# EAGLE design hexa4101 (EAGLE 5.11)
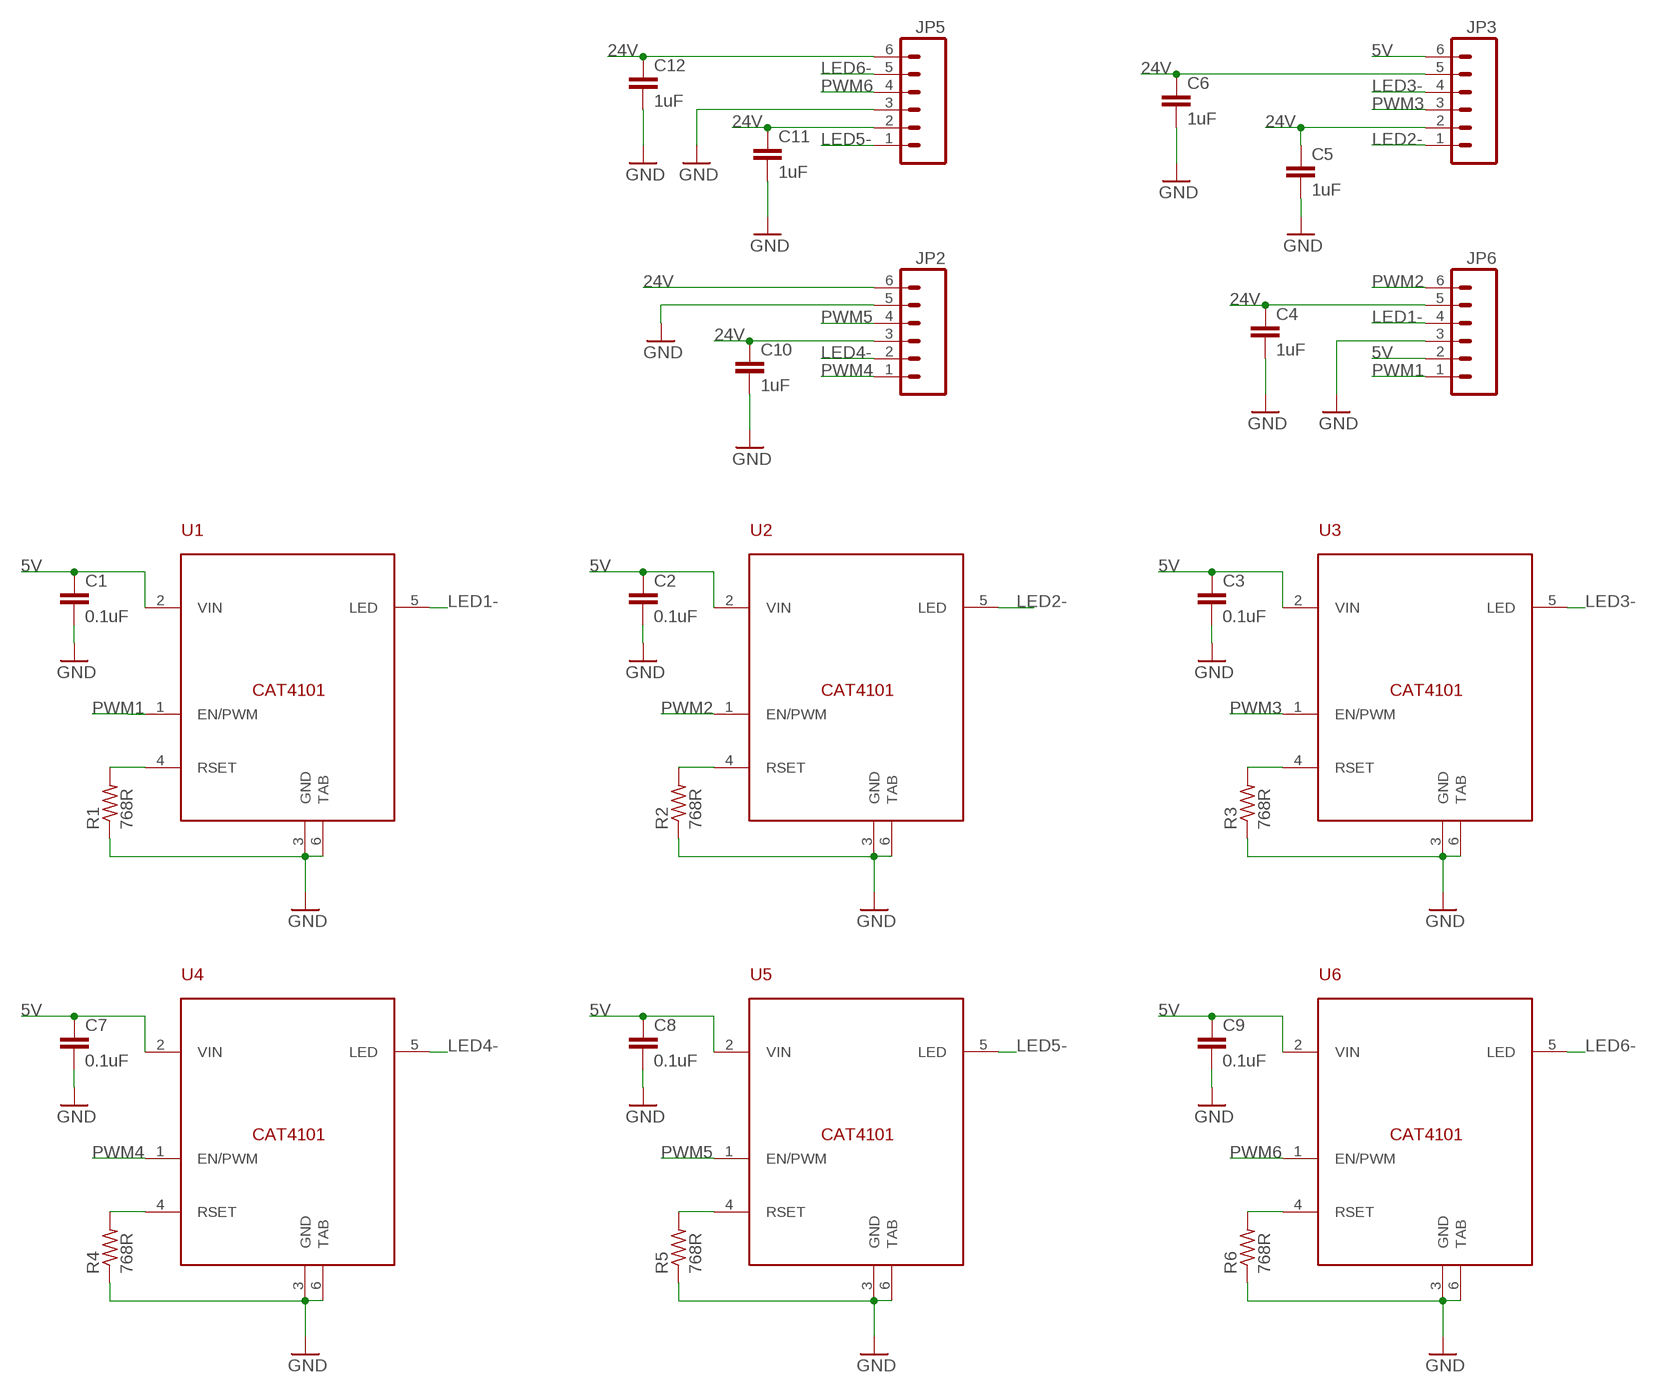
[diagram p0: schematic, sheet 1]

## Parts
C1  0.1uF  CAP1206  [C1206]
C2  0.1uF  CAP1206  [C1206]
C3  0.1uF  CAP1206  [C1206]
C4  1uF  CAP1206  [C1206]
C5  1uF  CAP1206  [C1206]
C6  1uF  CAP1206  [C1206]
C7  0.1uF  CAP1206  [C1206]
C8  0.1uF  CAP1206  [C1206]
C9  0.1uF  CAP1206  [C1206]
C10  1uF  CAP1206  [C1206]
C11  1uF  CAP1206  [C1206]
C12  1uF  CAP1206  [C1206]
JP2  M06SCREW3.5MM6  [SCREWTERMINAL-3.5MM-6]
JP3  M06SCREW3.5MM6  [SCREWTERMINAL-3.5MM-6]
JP5  M06SCREW3.5MM6  [SCREWTERMINAL-3.5MM-6]
JP6  M06SCREW3.5MM6  [SCREWTERMINAL-3.5MM-6]
R1  768R  R-US_R1206  [R1206]
R2  768R  R-US_R1206  [R1206]
R3  768R  R-US_R1206  [R1206]
R4  768R  R-US_R1206  [R1206]
R5  768R  R-US_R1206  [R1206]
R6  768R  R-US_R1206  [R1206]
U1  CAT4101  [TO263-51]
U2  CAT4101  [TO263-51]
U3  CAT4101  [TO263-51]
U4  CAT4101  [TO263-51]
U5  CAT4101  [TO263-51]
U6  CAT4101  [TO263-51]

## Nets
5V: C1.1 C2.1 C3.1 C7.1 C8.1 C9.1 JP3.6 JP6.2 U1.2(VIN) U2.2(VIN) U3.2(VIN) U4.2(VIN) U5.2(VIN) U6.2(VIN)
24V: C4.1 C5.1 C6.1 C10.1 C11.1 C12.1 JP2.3 JP2.6 JP3.2 JP3.5 JP5.2 JP5.6 JP6.5
GND: C1.2 C2.2 C3.2 C4.2 C5.2 C6.2 C7.2 C8.2 C9.2 C10.2 C11.2 C12.2 JP2.5 JP5.3 JP6.3 R1.1 R2.1 R3.1 R4.1 R5.1 R6.1 U1.3(GND) U1.6(TAB) U2.3(GND) U2.6(TAB) U3.3(GND) U3.6(TAB) U4.3(GND) U4.6(TAB) U5.3(GND) U5.6(TAB) U6.3(GND) U6.6(TAB)
LED1-: JP6.4 U1.5(LED)
LED2-: JP3.1 U2.5(LED)
LED3-: JP3.4 U3.5(LED)
LED4-: JP2.2 U4.5(LED)
LED5-: JP5.1 U5.5(LED)
LED6-: JP5.5 U6.5(LED)
N$1: R1.2 U1.4(RSET)
N$2: R2.2 U2.4(RSET)
N$3: R3.2 U3.4(RSET)
N$4: R4.2 U4.4(RSET)
N$5: R5.2 U5.4(RSET)
N$6: R6.2 U6.4(RSET)
PWM1: JP6.1 U1.1(EN/PWM)
PWM2: JP6.6 U2.1(EN/PWM)
PWM3: JP3.3 U3.1(EN/PWM)
PWM4: JP2.1 U4.1(EN/PWM)
PWM5: JP2.4 U5.1(EN/PWM)
PWM6: JP5.4 U6.1(EN/PWM)

## Library data of the parts
C1-C12 = _allyourbase:CAP: Capacitor Standard 0603 ceramic capacitor, and 0.1" leaded capacitor.
JP2 JP3 JP5 JP6 = _allyourbase:M06: Header 6 Standard 6-pin 0.1" header. Use with straight break away headers (SKU : PRT-00116), right angle break away headers (PRT-00553), swiss pins (PRT-00743), machine pins (PRT-00117), and female headers (PRT-00115). Molex polarized connector foot print use with SKU : PRT-08094 with associated crimp pins and housings. NOTES ON THE VARIANTS LOCK and LOCK_LONGPADS... This footprint was designed to help hold the alignment of a through-hole component (i.e. 6-pin header) while soldering it into place. You may notice that each hole has been shifted either up or down by 0.005 of an inch from it's more standard position (which is a perfectly straight line). This slight alteration caused the pins (the squares in the middle) to touch the edges of the holes. Because they are alternating, it causes a "brace" to hold the component in place. 0.005 has proven to be the perfect amount of "off-center" position when using our standard breakaway headers. Although looks a little odd when you look at the bare footprint, once you have a header in there, the alteration is very hard to notice. Also, if you push a header all the way into place, it is covered up entirely on the bottom side. This idea of altering the position of holes to aid alignment will be further integrated into the Sparkfun Library for other footprints. It can help hold any component with 3 or more connection pins.
R1-R6 = _allyourbase:R-US_: RESISTOR, American symbol
U1-U6 = _allyourbase:CAT4101

## Board
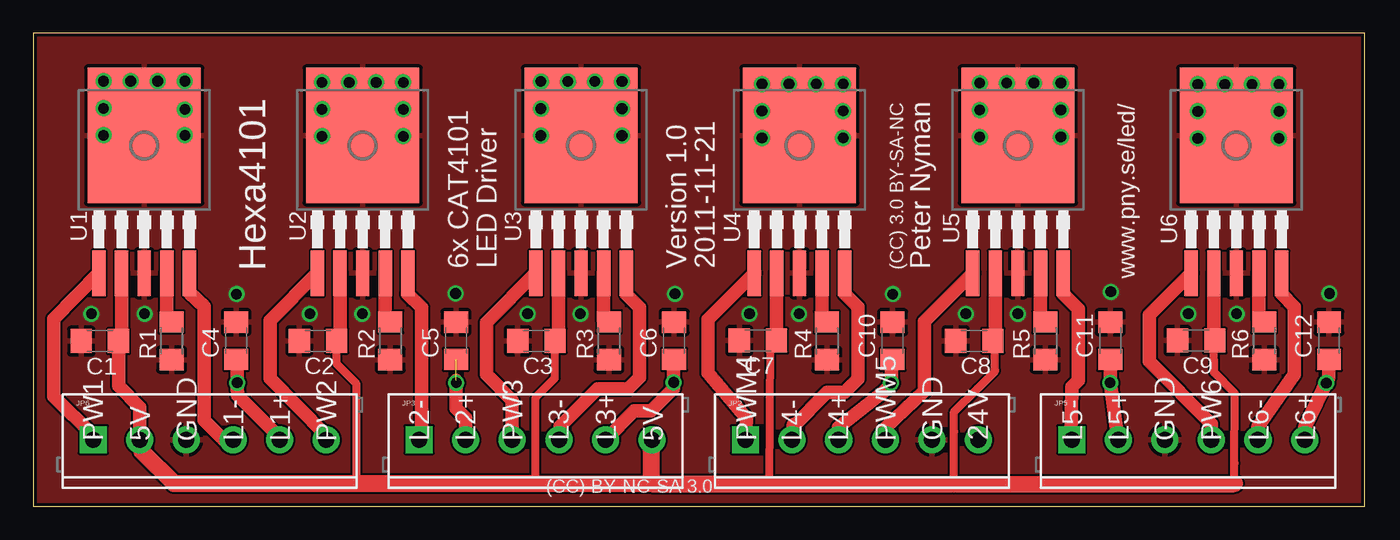
[diagram p1: board, top side]
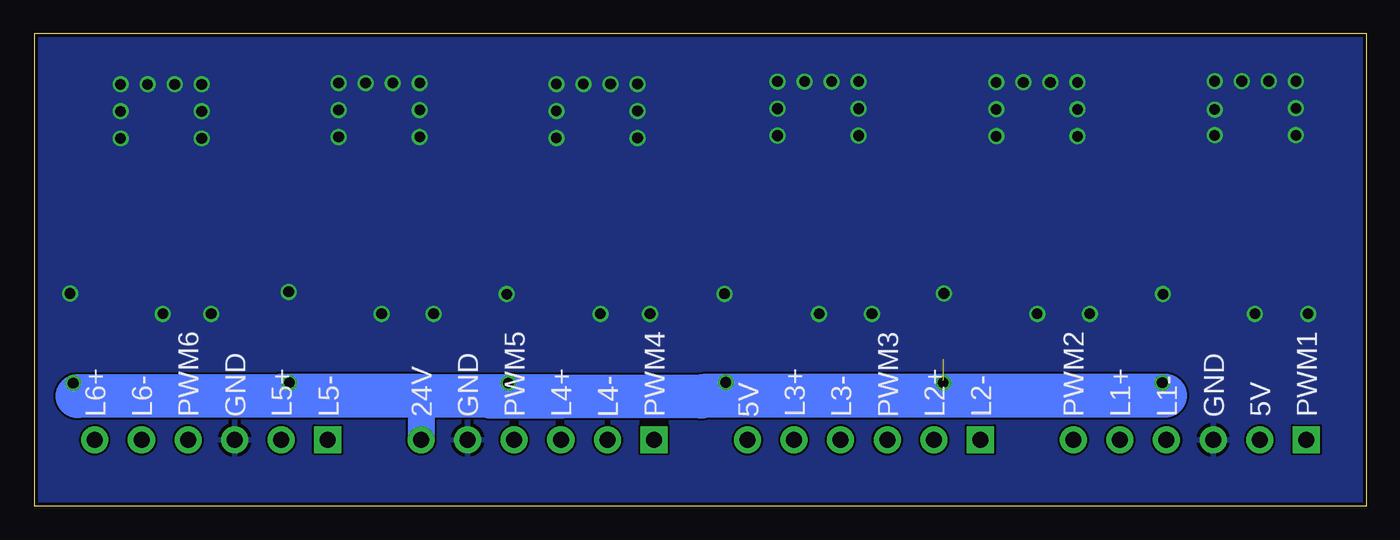
[diagram p2: board, bottom side, seen from below]

Size 100 x 35.56 mm. Coordinates in mm from the lower left corner, seen from the top.
Outline: 0,0 100,0 100,35.56 0,35.56 0,0
Copper layers (1*16): Top 0.035mm / dielectric 1.5mm / Bottom 0.035mm
Design rules "iTead-Seeed-DRC": minimum track width 6mil, minimum drill 12mil, track to track 6mil, track to pad 6mil, pad to pad 6mil, via to via 6mil, smd to smd 0mil, copper to edge 10mil, drill to drill 10mil, minimum pad ring 10mil, minimum via ring 6mil, stop-mask expansion 2mil, vias tented up to drill 100mil, thermal gap 10mil

### Footprints (pad centres in the part's own frame; a part is rotated, then mirrored left to right if it is on the bottom)
C1206 = smd 1.6 x 1.8: 1 -1.4,0; 2 1.4,0
SCREWTERMINAL-3.5MM-6 = drill 1.2 pad 2.032 square: 1 0,0 | drill 1.2 pad 2.032 round: 2 3.5,0; 3 7,0; 4 10.5,0; 5 14,0; 6 17.5,0
R1206 = smd 1.6 x 1.803: 1 -1.422,0; 2 1.422,0
TO263-51 = smd 1 x 3.4: 1 -3.4,-6.6; 2 -1.7,-6.6; 3 0,-6.6; 4 1.7,-6.6; 5 3.4,-6.6 | smd 8.5 x 10.16: 6 0,3.754

### Placement (x,y rotation side)
C1  5,12.42 180 top
C2  21.39,12.45 180 top
C3  37.8,12.45 180 top
C4  15.24,12.45 90 top
C5  31.75,12.45 90 top
C6  48.13,12.45 90 top
C7  54.43,12.47 180 top
C8  70.69,12.45 180 top
C9  87.35,12.47 180 top
C10  64.54,12.45 90 top
C11  80.9,12.45 90 top
C12  97.33,12.45 90 top
JP2  53.5,5 0 top
JP3  28.98,5 0 top
JP5  78,5 0 top
JP6  4.5,5 0 top
R1  10.39,12.45 90 top
R2  26.82,12.45 90 top
R3  43.23,12.45 90 top
R4  59.61,12.45 90 top
R5  76.02,12.45 90 top
R6  92.46,12.45 90 top
U1  8.33,24.13 0 top
U2  24.74,24.13 0 top
U3  41.15,24.13 0 top
U4  57.56,24.13 0 top
U5  73.96,24.13 0 top
U6  90.37,24.13 0 top

### Tracks (layer width: path | path; a pad name or v marks a point on that pad's centre or on a via)
5V
  Top 0.406: 88.67,12.52 C9.1 | 72.27,12.47 C8.1 72.24,12.45 | 55.83,17.55 U4.2 | 55.8,12.47 C7.1 | 46.46,5 JP3.6
  Top 0.61: 39.45,12.16 38.74,12.09 C3.1 39.19,10.18 39.19,9.65 37.74,8.2 37.74,1.72 | C1.1 6.63,12.22 | 23.04,12.6 C2.1 22.79,10.7 24.28,9.2 24.28,1.72 | 55.8,12.47 55.36,12.15 55.32,7 55.31,1.71 | 72.24,12.45 72.24,10.24 72.26,10.24 72.26,10.19 70.92,8.84 69.16,7.11 69.16,5.61 69.16,1.66 | U6.2 88.69,12.17 88.7,10.06 90.25,8.51 90.25,8.18 90.23,3.25 90.23,1.7
  Top 1.003: 39.45,12.16 U3.2 | 6.63,12.22 U1.2 | 23.04,12.6 U2.2 | U6.2 88.67,12.52 | 72.27,12.47 U5.2 | C7.1 55.83,17.55
  Top 1.016: C1.1 6.4,9.04 8,7.44 JP6.2 8.15,4.12
  Top 1.27: 46.46,1.72 37.74,1.72 24.28,1.72 10.57,1.72 8.15,4.12 | 46.46,1.72 55.31,1.71 69.16,1.66 90.23,1.7 | 46.46,1.72 46.46,5
24V  (via drill 0.8)  (1 unrouted)
  Top 0.406: 15.32,10.97 C4.1 | 15.32,8.99 v15.32,9.3 | 31.75,7.37 31.75,9.45 31.77,9.42 v31.77,9.3 | 48.11,11.02 C6.1 | 97.33,9.7 96.95,9.32 v97.13,9.27 | 32.47,5.08 JP3.2 | 43.01,5.03 JP3.5 | 64.47,10.82 C10.1 | 64.49,9.22 64.52,9.3 v64.44,9.27 | 80.92,10.92 C11.1 | 95.5,5.31 JP5.6 | JP2.3 60.66,5.33 60.48,5.08 | 81.47,5.04 JP5.2
  Top 1.016: JP6.5 18.5,5.18 15.34,8.34 15.32,8.99 | 31.77,9.47 31.75,7.37 32.47,6.65 32.47,5.08 | v15.32,9.3 15.32,10.97 | 48.11,11.02 v48.11,9.32 48.11,8.87 46.4,7.16 45.14,7.16 43.01,5.03 | 64.03,8.76 60.48,5.94 60.48,5.08 | 64.03,8.76 64.49,9.22 64.47,9.55 | 64.03,8.76 64.01,8.74 | 64.47,9.55 64.47,9.53 | 64.47,9.55 64.47,10.82 | 80.92,10.92 v80.9,9.3 81.47,5.04 | C12.1 97.33,9.7 95.5,5.94 95.5,5.31
  Bottom 0.406: 15.77,7.52 17.12,8.64 17.58,8.87 19.13,8.46 | 17.53,8.33 16.97,7.42 15.12,8.31 | 31.75,9.42 v31.77,9.3 32.13,9.04 30.79,8.31 | 49.58,8.31 49,8 | v48.11,9.32 48.9,8.13 49.96,8.26 | v97.13,9.27 97,9.14 96.83,8.28 | v64.44,9.27 64.44,8.87 64.36,8.79 64.81,8.74 65.81,8.24 | v80.9,9.3 80.92,9.42 80.95,9.4 80.95,8.17 81.1,8.32
  Bottom 0.813: 19.13,8.46 17.53,8.33
  Bottom 1.016: v15.32,9.3 15.77,7.52
  Bottom 2.032: 70.97,8.29 JP2.6
  Bottom 3.302: 15.12,8.31 30.79,8.31 49.58,8.31 49.96,8.26 65.81,8.24 60.52,8.27 70.97,8.29 81.1,8.32 81.51,8.32 96.83,8.28
GND  (via drill 0.8)
  Top 0.406: R1.1 10.3,10.96
  other vias: 11.38,31.95 5.28,27.89 9.35,31.95 21.69,29.84 21.69,27.81 27.79,27.81 27.79,29.84 38.13,29.9 38.13,27.86 44.22,27.86 44.22,29.9 8.36,14.48 24.71,14.48 41.1,14.48 5.28,29.92 5.28,31.95 7.32,31.95 27.79,31.88 25.76,31.88 23.72,31.88 21.69,31.88 44.22,31.93 42.19,31.93 40.16,31.93 38.13,31.93 57.53,14.48 73.96,14.48 90.4,14.48 54.74,29.72 54.74,27.69 60.83,27.69 60.83,29.72 60.83,31.75 58.8,31.75 56.77,31.75 54.74,31.75 71.09,29.79 71.09,27.76 77.19,27.76 77.19,29.79 77.19,31.83 75.16,31.83 73.13,31.83 71.09,31.83 87.48,29.69 87.48,27.66 93.57,27.66 93.57,29.69 93.57,31.72 91.54,31.72 89.51,31.72 87.48,31.72 11.38,29.83 11.38,27.89 4.37,14.48 20.78,14.48 37.13,14.48 53.8,14.48 70.05,14.48 86.77,14.48 15.27,15.95 31.72,16 48.21,15.98 64.57,15.95 80.95,16.13 97.36,16
  pour Top: 0,35.56 100,35.56 100.05,0.13 0.13,0.25
  pour Bottom: 0,35.56 100,35.56 100,0.25 0,0.25
LED1-
  Top 0.406: U1.5 11.66,16.56 11.76,16.03
  Top 1.016: 11.76,16.03 12.83,15.01 12.83,6.45 14.29,4.99 JP6.4
LED2-
  Top 0.406: U2.5 28.12,17.51 28.12,15.98 | 29.16,7.39 29.16,7.37 29.13,7.39 29.11,7.39 29.11,7.34 29.16,7.39 | 29.16,7.39 29.16,7.49 29.15,7.49
  Top 1.016: 28.12,15.98 29.16,14.94 29.16,7.49 | 29.15,7.49 29.15,5.24 28.97,4.94 JP3.1
LED3-
  Top 0.406: U3.5 44.58,17.5 44.58,15.93 | JP3.4 39.52,5.22
  Top 1.016: 44.58,15.93 45.54,14.96 45.54,9.7 44.7,8.87 42.37,8.84 39.57,6.02 39.52,5.22
LED4-
  Top 0.406: 60.96,15.98 U4.5 | JP2.2 57.05,5.11
  Top 1.016: 60.96,15.98 61.95,14.99 61.95,9.58 60.94,8.56 59.61,8.56 57.05,5.99 57.05,6.07 57.1,6.12 | 57.05,5.11 57.1,6.12 | 57.1,6.12 57.15,6.17
LED5-
  Top 0.406: 77.36,15.98 U5.5 | JP5.1 77.95,4.98
  Top 1.016: 77.36,15.98 78.51,14.83 78.49,9.47 78,9 77.93,5.14 77.98,4.95 77.88,5.01 77.93,5.03 77.95,4.98
LED6-
  Top 0.406: 93.77,15.96 U6.5 | JP5.5 92.02,5.21
  Top 1.016: 93.77,15.96 94.74,14.99 94.74,9.91 92,5.97 92.02,5.21
N$1
  Top 0.813: 10.03,13.85 R1.2
  Top 1.016: 10.03,13.85 U1.4
N$2
  Top 0.813: R2.2 26.44,13.69
  Top 1.003: 26.44,13.69 U2.4
N$3
  Top 0.813: 42.85,14 R3.2
  Top 1.003: 42.85,14 U3.4
N$4
  Top 0.406: R4.2 59.26,13.7
  Top 1.003: 59.26,13.7 U4.4
N$5
  Top 0.406: R5.2 75.67,13.67
  Top 1.003: 75.67,13.67 U5.4
N$6
  Top 0.406: R6.2 92.07,14.12
  Top 1.003: 92.07,14.12 U6.4
PWM1
  Top 1.016: U1.1 1.55,14.1 1.55,8.28 4.55,5.28 4.57,5.05 JP6.1
PWM2
  Top 1.016: U2.1 17.78,13.97 17.78,9.6 21.97,5.36 JP6.6
PWM3
  Top 1.016: U3.1 34.04,13.82 34.04,9.91 35.98,7.96 JP3.3
PWM4
  Top 1.016: U4.1 50.67,14.05 50.67,10.03 53.57,6.63 JP2.1
PWM5
  Top 0.406: JP2.4 64.14,5 63.98,5.03
  Top 1.016: U5.1 66.93,13.89 66.93,8.69 63.98,5.85 63.98,5.03
PWM6
  Top 0.406: U6.1 86.97,16.15 87.12,16
  Top 1.016: JP5.4 88.48,6.21 83.82,10.9 83.82,14.38 U6.1

### Text on the board
tPlace: Hexa4101 | 6x CAT4101 | LED Driver | Version 1.0 | 2011-11-21 | (CC) 3.0 BY-SA-NC | Peter Nyman | www.pny.se/led/ | PW1 | 5V | GND | L1- | L1+ | PW2 | L2- | L2+ | PW3 | L3- | L3+ | 5V | PWM4 | L4- | L4+ | PWM5 | GND | 24V | L5- | L5+ | GND | PW6 | L6- | L6+ | (CC) BY-NC-SA 3.0
bPlace: PWM1 | 5V | GND | L1- | L1+ | PWM2 | L2- | L2+ | PWM3 | L3- | L3+ | 5V | PWM4 | L4- | L4+ | PWM5 | GND | 24V | L5- | L5+ | GND | PWM6 | L6- | L6+